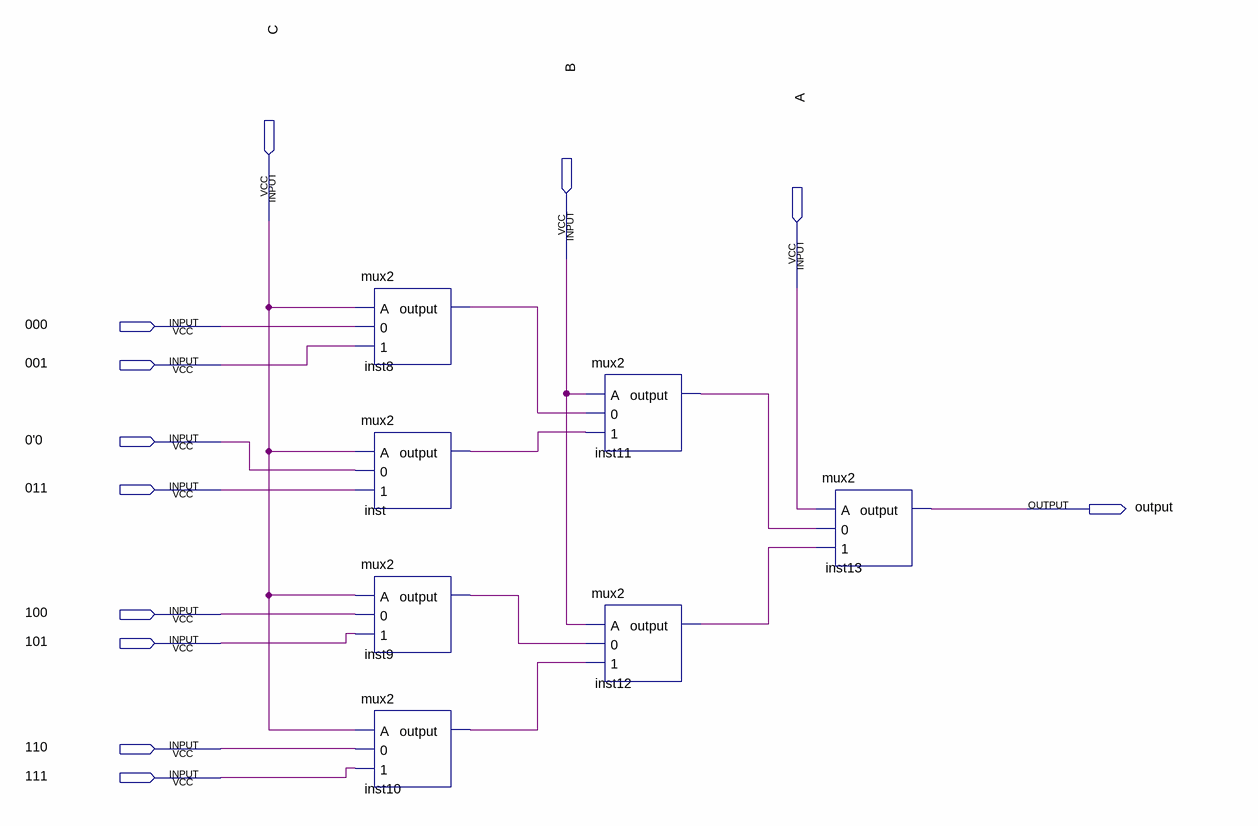
[diagram p0: schematic sheet]
// Quartus schematic mux8.bdf as structural Verilog: 7 symbols, 12 pins
module mux8 (
  input  C,
  input  B,
  input  A,
  input  \000 ,
  input  \001 ,
  input  \0'0 ,
  input  \011 ,
  input  \100 ,
  input  \101 ,
  input  \110 ,
  input  \111 ,
  output \output 
);

  wire inst8_output, inst9_output, inst10_output, inst11_output, inst12_output, inst_output;

  mux2 inst8 (.A(C), .\0 (\000 ), .\1 (\001 ), .\output (inst8_output));
  mux2 inst (.A(C), .\0 (\0'0 ), .\1 (\011 ), .\output (inst_output));
  mux2 inst9 (.A(C), .\0 (\100 ), .\1 (\101 ), .\output (inst9_output));
  mux2 inst10 (.A(C), .\0 (\110 ), .\1 (\111 ), .\output (inst10_output));
  mux2 inst11 (.A(B), .\0 (inst8_output), .\1 (inst_output), .\output (inst11_output));
  mux2 inst12 (.A(B), .\0 (inst9_output), .\1 (inst10_output), .\output (inst12_output));
  mux2 inst13 (.A(A), .\0 (inst11_output), .\1 (inst12_output), .\output (\output ));
endmodule
